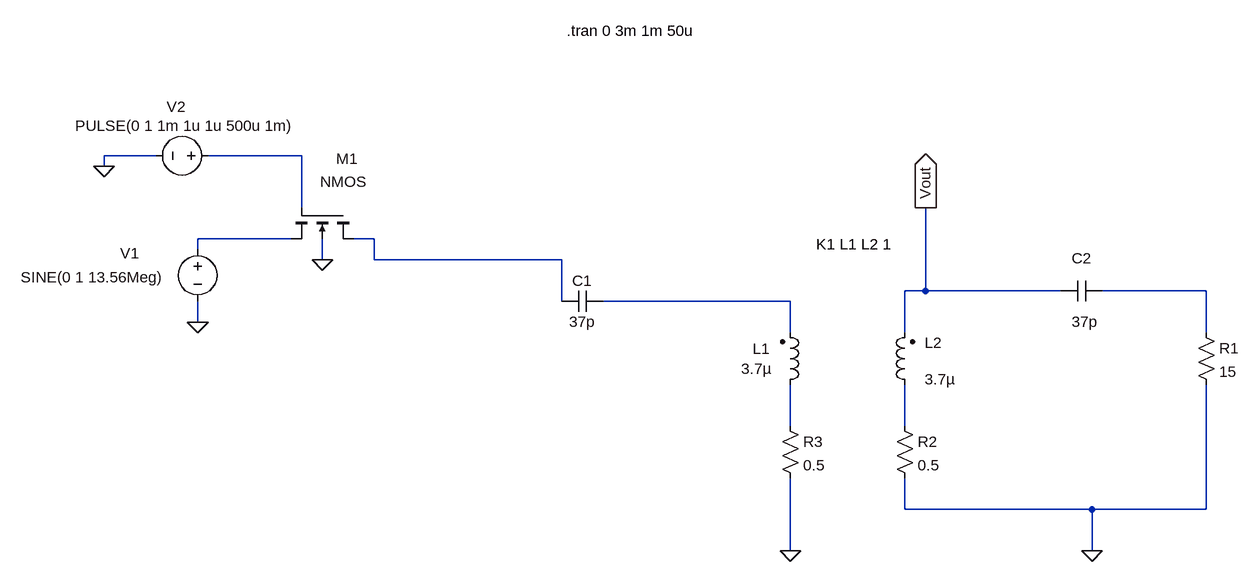
[diagram p0: schematic NFMIPrototype.asc]
NFMIPrototype.asc, the LTspice schematic file:
Version 4
SHEET 1 1384 680
WIRE -288 -256 -368 -256
WIRE -64 -256 -208 -256
WIRE -368 -240 -368 -256
WIRE -64 -176 -64 -256
WIRE -80 -128 -224 -128
WIRE 48 -128 16 -128
WIRE -224 -112 -224 -128
WIRE -32 -96 -32 -128
WIRE 48 -96 48 -128
WIRE 336 -96 48 -96
WIRE 896 -48 896 -176
WIRE 896 -48 864 -48
WIRE 1104 -48 896 -48
WIRE 1328 -48 1168 -48
WIRE 336 -32 336 -96
WIRE 688 -32 400 -32
WIRE -224 0 -224 -32
WIRE 688 16 688 -32
WIRE 864 16 864 -48
WIRE 1328 16 1328 -48
WIRE 688 160 688 96
WIRE 864 160 864 96
WIRE 864 288 864 240
WIRE 1152 288 864 288
WIRE 1328 288 1328 96
WIRE 1328 288 1152 288
WIRE 688 352 688 240
WIRE 1152 352 1152 288
FLAG -368 -240 0
FLAG -224 0 0
FLAG -32 -96 0
FLAG 688 352 0
FLAG 1152 352 0
FLAG 896 -176 Vout
IOPIN 896 -176 Out
SYMBOL voltage -224 -128 R0
WINDOW 0 -119 22 Left 2
WINDOW 3 -272 59 Left 2
WINDOW 123 0 0 Left 0
WINDOW 39 0 0 Left 0
SYMATTR InstName V1
SYMATTR Value SINE(0 1 13.56Meg)
SYMBOL voltage -192 -256 R90
WINDOW 0 -75 50 VRight 2
WINDOW 3 -46 -117 VRight 2
WINDOW 123 0 0 Left 0
WINDOW 39 0 0 Left 0
SYMATTR InstName V2
SYMATTR Value PULSE(0 1 1m 1u 1u 500u 1m)
SYMBOL ind2 672 112 M180
WINDOW 0 -42 71 Left 2
WINDOW 3 -60 40 Left 2
SYMATTR InstName L1
SYMATTR Value 3.7µ
SYMATTR Type ind
SYMBOL cap 400 -16 M270
WINDOW 0 32 32 VTop 2
WINDOW 3 0 32 VBottom 2
SYMATTR InstName C1
SYMATTR Value 37p
SYMBOL res 1312 0 R0
SYMATTR InstName R1
SYMATTR Value 15
SYMBOL ind2 880 112 R180
WINDOW 0 -42 80 Left 2
WINDOW 3 -62 24 Left 2
SYMATTR InstName L2
SYMATTR Value 3.7µ
SYMATTR Type ind
SYMBOL cap 1168 -32 M270
WINDOW 0 51 32 VTop 2
WINDOW 3 -16 27 VBottom 2
SYMATTR InstName C2
SYMATTR Value 37p
SYMBOL res 848 144 R0
SYMATTR InstName R2
SYMATTR Value 0.5
SYMBOL res 672 144 R0
SYMATTR InstName R3
SYMATTR Value 0.5
SYMBOL nmos4 16 -176 R90
WINDOW 0 -75 -7 VRight 2
WINDOW 3 -40 -21 VRight 2
SYMATTR InstName M1
SYMATTR Value2 l=1080n w=1080n
TEXT 728 -120 Left 2 !K1 L1 L2 1
TEXT 344 -448 Left 2 !.tran 0 3m 1m 50u

The netlist it stands for:
* NFMIPrototype.asc
V1 N002 0 SINE(0 1 13.56Meg)
V2 N001 0 PULSE(0 1 1m 1u 1u 500u 1m)
L1 N006 N005 3.7µ
C1 N005 N003 37p
R1 N004 0 15
L2 N007 Vout 3.7µ
C2 N004 Vout 37p
R2 N007 0 0.5
R3 N006 0 0.5
M1 N003 N001 N002 0 NMOS l=1080n w=1080n
.model NMOS NMOS
.model PMOS PMOS
.lib standard.mos
K1 L1 L2 1
.tran 0 3m 1m 50u
.backanno
.end